# Altium schematic sheet Input_Protection.SchDoc: Input Protection
size 431 x 279 mm; Author: Shivam Sharma; SheetNumber: 9; SheetTotal: 14; SheetRevision: 1.0
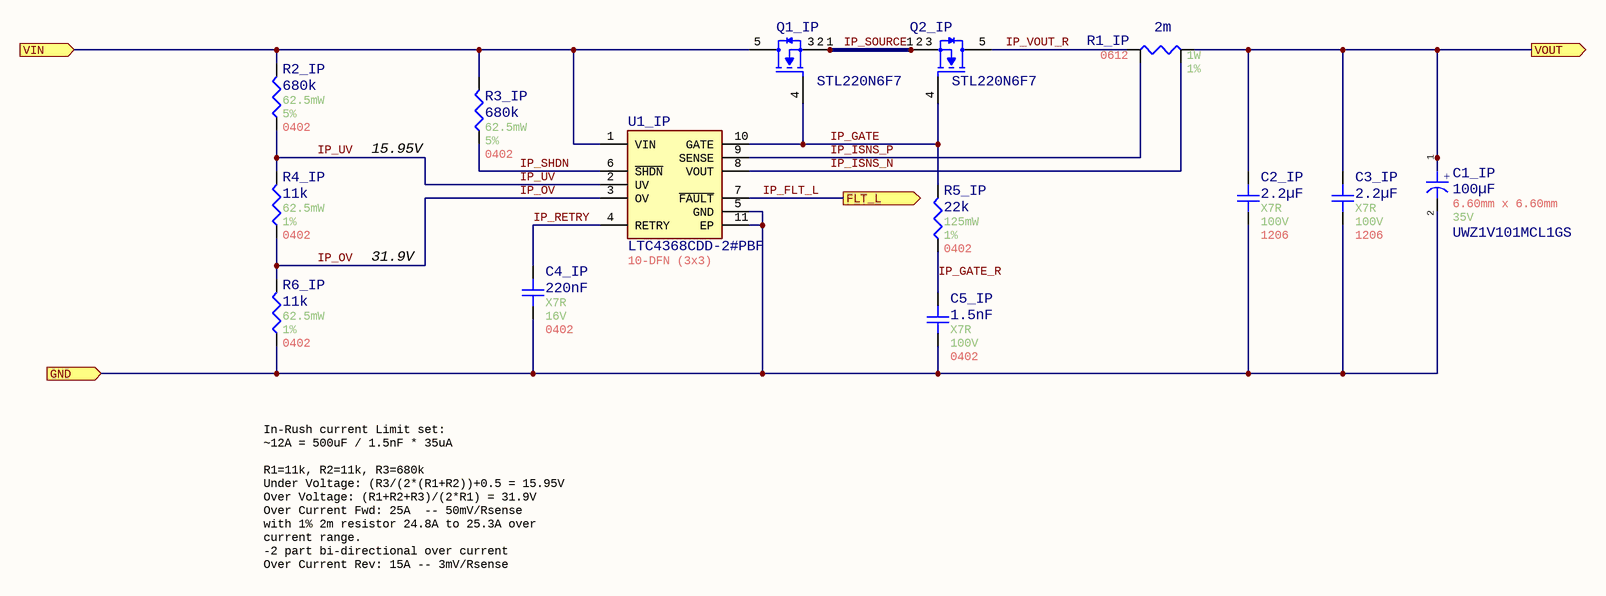
[diagram p0: Input_Protection.SchDoc]

## Parts
C1_IP  UWZ1V101MCL1GS  value 100µF  Case/Package: 6.60mm x 6.60mm  Voltage Rating: 35V  [UWZ1V101MCL1GS]
C2_IP  value 2.2µF  Temperature Coefficient: X7R  Voltage Rating: 100V  Case/Package: 1206  [Generic 1206 Capacitor]  (hidden comment: 12061C225K4T2A)
C3_IP  value 2.2µF  Temperature Coefficient: X7R  Voltage Rating: 100V  Case/Package: 1206  [Generic 1206 Capacitor]  (hidden comment: 12061C225K4T2A)
C4_IP  value 220nF  Temperature Coefficient: X7R  Voltage Rating: 16V  Case/Package: 0402  [Generic 0402 capacitor]  (hidden comment: GCM155R71C224ME02D)
C5_IP  value 1.5nF  Temperature Coefficient: X7R  Voltage Rating: 100V  Case/Package: 0402  [Generic 0402 capacitor]  (hidden comment: GCM155R72A152KA37D)
Q1_IP  STL220N6F7  [STL220N6F7]
Q2_IP  STL220N6F7  [STL220N6F7]
R1_IP  value 2m  Power: 1W  Tolerance: 1%  Case/Package: 0612  [FP-WSKW0612-MFG]  (hidden comment: WSKW06122L000FEA)
R2_IP  value 680k  Power: 62.5mW  Tolerance: 5%  Case/Package: 0402  [Generic 0402 Resistor]  (hidden comment: AC0402JR-07680KL)
R3_IP  value 680k  Power: 62.5mW  Tolerance: 5%  Case/Package: 0402  [Generic 0402 Resistor]  (hidden comment: AC0402JR-07680KL)
R4_IP  value 11k  Power: 62.5mW  Tolerance: 1%  Case/Package: 0402  [Generic 0402 Resistor]  (hidden comment: RMCF0402FT11K0)
R5_IP  value 22k  Power: 125mW  Tolerance: 1%  Case/Package: 0402  [Generic 0402 Resistor]  (hidden comment: AC0402FR-7W22KL)
R6_IP  value 11k  Power: 62.5mW  Tolerance: 1%  Case/Package: 0402  [Generic 0402 Resistor]  (hidden comment: RMCF0402FT11K0)
U1_IP  LTC4368CDD-2#PBF  Case/Package: 10-DFN (3x3)  [DFN-10_3x3x0.8mm_P0.5mm]

## Ports
FLT_L (out), GND (in), VIN (in), VOUT (out)

## Nets
GND: C1_IP.2 C2_IP.1 C3_IP.1 C4_IP.1 C5_IP.1 R6_IP.1 U1_IP.5(GND) U1_IP.11(EP) ; port GND
IP_FLT_L: U1_IP.7(~{FAULT}) ; port FLT_L
IP_GATE: Q1_IP.4(GATE) Q2_IP.4(GATE) R5_IP.2 U1_IP.10(GATE)
IP_GATE_R: C5_IP.2 R5_IP.1
IP_ISNS_N: R1_IP.S2 U1_IP.8(VOUT)
IP_ISNS_P: R1_IP.S1 U1_IP.9(SENSE)
IP_OV: R4_IP.1 R6_IP.2 U1_IP.3(OV)
IP_RETRY: C4_IP.2 U1_IP.4(RETRY)
IP_SHDN: R3_IP.1 U1_IP.6(~{SHDN})
IP_SOURCE: Q1_IP.1(SOURCE) Q1_IP.2(SOURCE) Q1_IP.3(SOURCE) Q2_IP.1(SOURCE) Q2_IP.2(SOURCE) Q2_IP.3(SOURCE)
IP_UV: R2_IP.1 R4_IP.2 U1_IP.2(UV)
IP_VOUT_R: Q2_IP.5(DRAIN) R1_IP.1
VIN: Q1_IP.5(DRAIN) R2_IP.2 R3_IP.2 U1_IP.1(VIN) ; port VIN
VOUT: C1_IP.1 C2_IP.2 C3_IP.2 R1_IP.2 ; port VOUT

## Notes on the sheet
- 15.95V
- 31.9V
- In-Rush current Limit set:
  ~12A = 500uF / 1.5nF * 35uA
  R1=11k, R2=11k, R3=680k
  Under Voltage: (R3/(2*(R1+R2))+0.5 = 15.95V
  Over Voltage: (R1+R2+R3)/(2*R1) = 31.9V
  Over Current Fwd: 25A  -- 50mV/Rsense
  with 1% 2m resistor 24.8A to 25.3A over current range.
  -2 part bi-directional over current
  Over Current Rev: 15A -- 3mV/Rsense
- Title:
- Author:
- Approved:
- Size:
- Date:
- Git Hash:
- Sch Revision:
- B
- Prj:
- Sheet Revision:
- Variant:
- Edited:
- CONFIDENTIAL
- File:
- (in symbol CMP-001-00099-2) +

## Library data of the parts
C1_IP = CMP-001-00099-2: Aluminum Electrolytic Capacitor, Polarized, Aluminum (wet), 35V, 20% +Tol, 20% -Tol, 100uF, Surface Mount, 2626; AECQ: Yes; Capacitor Type: Aluminium; Ripple Current: 84mA; Pins: 2; Max Operating Temperature: 105°C; Min Operating Temperature: -55°C; RoHS Compliant: Yes; Mounting Technology: Surface Mount
C2_IP C3_IP = CMP-001-00086-3: Ceramic Capacitor, Multilayer, Ceramic, 100V, 10% +Tol, 10% -Tol, X7R, 15% TC, 2.2uF, Surface Mount, 1206; AECQ: Yes; Capacitor Type: Ceramic; Max Operating Temperature: -55°C; Tolerance: 10%; Min Operating Temperature: 125°C; Pins: 2; RoHS Compliant: Yes; Mounting Technology: SMD
C4_IP = CMP-001-00103-2: Ceramic Capacitor, Multilayer, Ceramic, 16V, 20% +Tol, 20% -Tol, X7R, 15% TC, 0.22uF, Surface Mount, 0402; AECQ: Yes; Max Operating Temperature: 125°C; Min Operating Temperature: -55°C; Mounting Technology: SMD; Pins: 2; Capacitor Type: Ceramic; Tolerance: 20%
C5_IP = CMP-001-00102-3: Ceramic Capacitor, Multilayer, Ceramic, 100V, 10% +Tol, 10% -Tol, X7R, 15% TC, 0.0015uF, Surface Mount, 0402; AECQ: Yes; Capacitor Type: Ceramic; Min Operating Temperature: -55°C; Mounting Technology: SMD; Max Operating Temperature: 125°C; Tolerance: 10%; Pins: 2
Q1_IP Q2_IP = CMP-013-00035-1: Power Field-Effect Transistor, 120A I(D), 60V, 0.0014ohm, 1-Element, N-Channel, Silicon, Metal-oxide Semiconductor FET; Transistor Type: n-FET; Power: 4.8W; Min Operating Temperature: -55°C; Pins: 8; Case/Package: 8-PowerVDFN; RoHS Compliant: Yes; Max Operating Temperature: 175°C
R1_IP = CMP-009-00192-1: Fixed Resistor, Metal Strip, 1W, 0.002ohm, 0.045V, 1% +/-Tol, 150ppm/Cel, Surface Mount, 0612; Manufacturer Part Number: TFA0805R60R4F-T5; AECQ: Yes; Mounting Technology: Surface Mount; Min Operating Temperature: -65°C; Max Operating Temperature: 170°C; RoHS Compliant: Yes; Pins: 4
R2_IP R3_IP = CMP-009-00199-3: Fixed Resistor, Metal Glaze/thick Film, 0.0625W, 680000ohm, 50V, 5% +/-Tol, 100ppm/Cel, Surface Mount, 0402; AECQ: Yes; Mounting Technology: SMD; Pins: 2; Min Operating Temperature: -55°C; Max Operating Temperature: 155°C
R4_IP R6_IP = CMP-009-00221-1: Res Thick Film 0402 11K Ohm 1% 0.063W(1/16W) ±100ppm/C Pad SMD Automotive T/R; AECQ: Yes; Pins: 2; RoHS Compliant: Yes; Max Operating Temperature: 155°C; Mounting Technology: Surface Mount; Min Operating Temperature: -55°C
R5_IP = CMP-009-00193-3: Fixed Resistor, Metal Glaze/thick Film, 0.125W, 22000ohm, 75V, 1% +/-Tol, 100ppm/Cel, Surface Mount, 0402; AECQ: Yes; Manufacturer Part Number: AC0402FR-7W22KL; Mounting Technology: SMD; Pins: 2; Max Operating Temperature: 155°C; Min Operating Temperature: -55°C
U1_IP = CMP-031-00016-1: 100V UV/OV and Reverse Protection Controller with Bidirectional Circuit Breaker; MPN: LTC4368CMS-1#PBF; AECQ: Yes; Mounting Technology: SMD; Pins: 10; Max Operating Temperature: 70°C; Min Operating Temperature: 0°C; RoHS Compliant: Yes